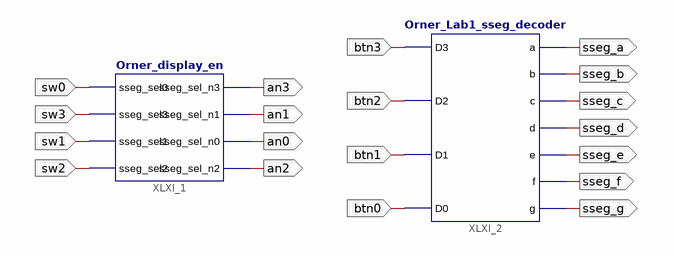
[diagram p0: schematic sheet 1]
// Xilinx ISE schematic Orner_Lab1_Top.sch (spartan3e) as structural Verilog: 2 symbols, 19 ports
module Orner_Lab1_Top (
  input  sw0,
  input  sw3,
  input  sw1,
  input  sw2,
  input  btn3,
  input  btn2,
  input  btn1,
  input  btn0,
  output sseg_a,
  output sseg_b,
  output sseg_c,
  output sseg_d,
  output sseg_e,
  output sseg_f,
  output sseg_g,
  output an3,
  output an1,
  output an0,
  output an2
);

  Orner_display_en XLXI_1 (
    .sseg_sel0(sw0), .sseg_sel3(sw3), .sseg_sel1(sw1), .sseg_sel2(sw2), .sseg_sel_n3(an3), .sseg_sel_n1(an1),
    .sseg_sel_n0(an0), .sseg_sel_n2(an2));
  Orner_Lab1_sseg_decoder XLXI_2 (
    .D3(btn3), .D2(btn2), .D1(btn1), .D0(btn0), .a(sseg_a), .b(sseg_b), .c(sseg_c), .d(sseg_d), .e(sseg_e),
    .f(sseg_f), .g(sseg_g));
endmodule
